# Altium schematic sheet power.SchDoc
size A4
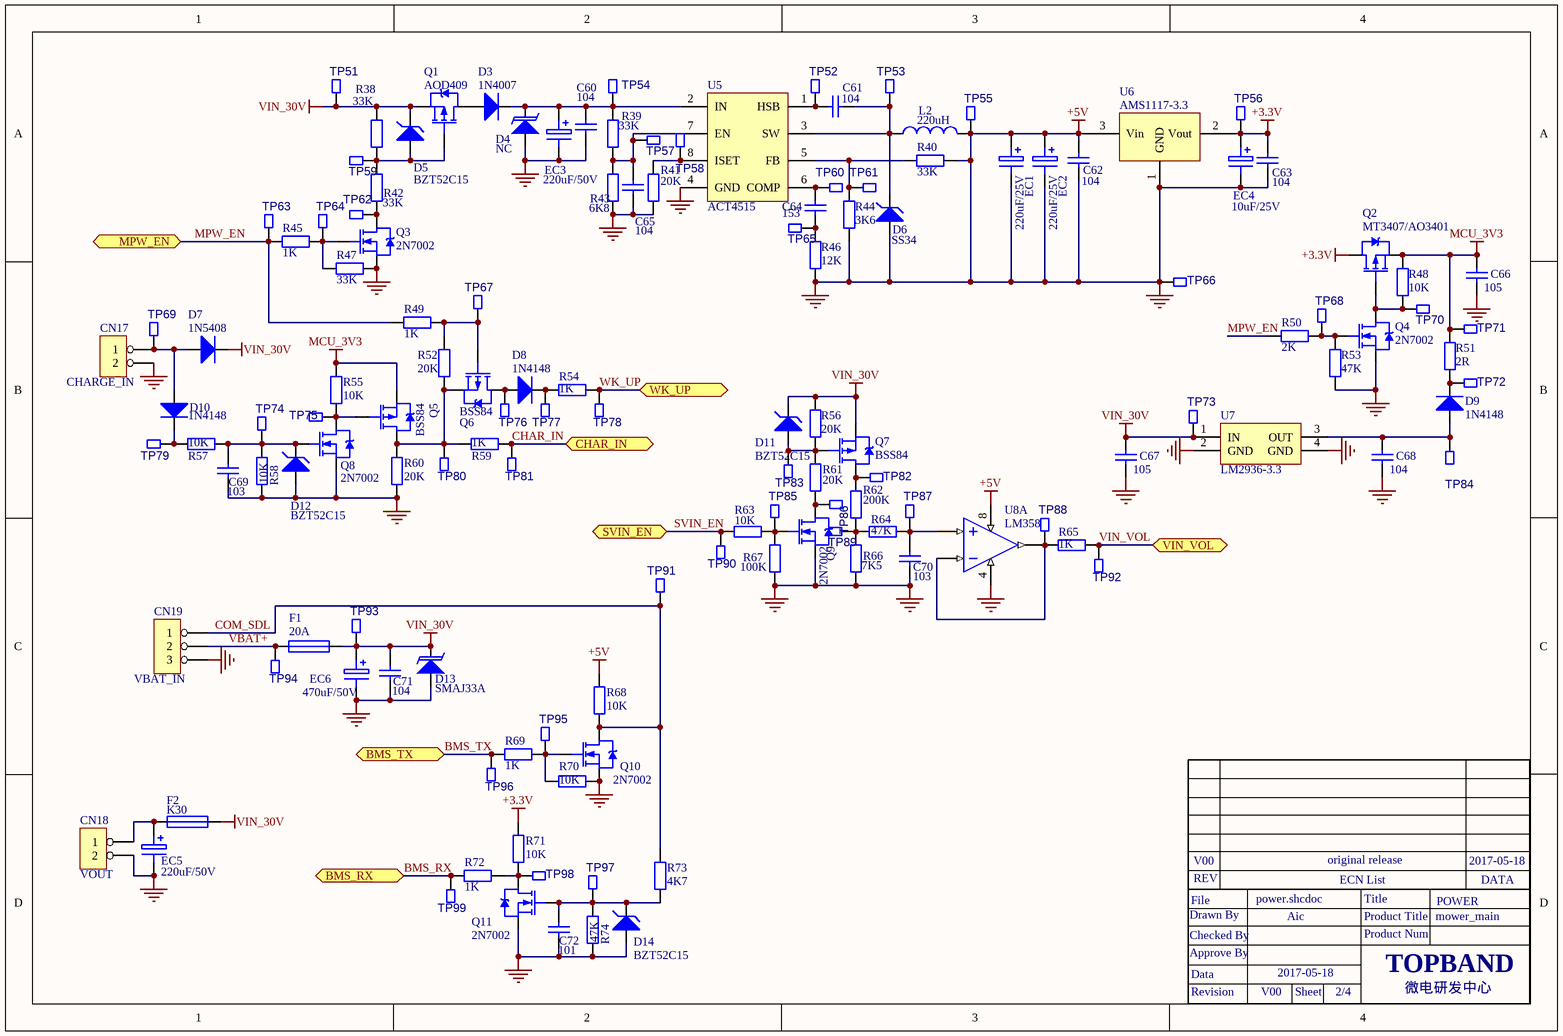
[diagram p0: power.SchDoc]

## Parts
C60  104  [0603C]
C61  104  [0603C]
C62  104  [0603C]
C63  104  [0603C]
C64  153  [0603C]
C65  104  [0603C]
C66  105  [0603C]
C67  105  [0603C]
C68  104  [0603C]
C69  103  [0603C]
C70  103  [0603C]
C71  104  [0805C]
C72  101  [0603C]
CN17  CHARGE_IN  [CON2-2.54]
CN18  VOUT  [CON2-3.96]
CN19  VBAT_IN  [CON3-3.96]
D3  1N4007  [SMA]
D4  NC  [SOD-123]
D5  BZT52C15  [SOD-123]
D6  SS34  [SMA]
D7  1N5408  [DIODE]
D8  1N4148  [SOD-123]
D9  1N4148  [SOD-123]
D10  1N4148  [SOD-123]
D11  BZT52C15  [SOD-123]
D12  BZT52C15  [SOD-123]
D13  SMAJ33A  [DO-214AC]
D14  BZT52C15  [SOD-123]
EC1  220uF/25V  [EC10]
EC2  220uF/25V  [EC10]
EC3  220uF/50V  [EC10]
EC4  10uF/25V  [EC4]
EC5  220uF/50V  [EC10]
EC6  470uF/50V  [EC12.5]
F1  20A  [  ]
F2  K30  [ ]
L2  220uH  [150700618]
Q1  AOD409  [D-PACK-GDS]
Q2  MT3407/AO3401  [SOT23-GDS]
Q3  2N7002  [SOT23-GDS]
Q4  2N7002  [SOD23-GDS]
Q5  BSS84  [SOT-23-GDS]
Q6  BSS84  [SOT-23-GDS]
Q7  BSS84  [SOT-23-GDS]
Q8  2N7002  [SOT-23-GDS]
Q9  2N7002  [SOT-23-GDS]
Q10  2N7002  [SOT-23-GDS]
Q11  2N7002  [SOT-23-GDS]
R38  33K  [0603R]
R39  33K  [0603R]
R40  33K  [0603R]
R41  20K  [0603R]
R42  33K  [0603R]
R43  6K8  [0603R]
R44  3K6  [0603R]
R45  1K  [0603R]
R46  12K  [0603R]
R47  33K  [0603R]
R48  10K  [0603R]
R49  1K  [0603R]
R50  2K  [0603R]
R51  2R  [1206R]
R52  20K  [0603R]
R53  47K  [0603R]
R54  1K  [0603R]
R55  10K  [0603R]
R56  20K  [0603R]
R57  10K  [0603R]
R58  10K  [0603R]
R59  1K  [0603R]
R60  20K  [0603R]
R61  20K  [0603R]
R62  200K  [0603R]
R63  10K  [0603R]
R64  47K  [0603R]
R65  1K  [0603R]
R66  7K5  [0603R]
R67  100K  [0603R]
R68  10K  [0603R]
R69  1K  [0603R]
R70  10K  [0603R]
R71  10K  [0603R]
R72  1K  [0603R]
R73  4K7  [0603R]
R74  47K  [0603R]
TP51  TP  [TEST-0.8MM]  (value not drawn)
TP52  TP  [TEST-0.8MM]  (value not drawn)
TP53  TP  [TEST-0.8MM]  (value not drawn)
TP54  TP  [TEST-0.8MM]  (value not drawn)
TP55  TP  [TEST-0.8MM]  (value not drawn)
TP56  TP  [TEST-0.8MM]  (value not drawn)
TP57  TP  [TEST-0.8MM]  (value not drawn)
TP58  TP  [TEST-0.8MM]  (value not drawn)
TP59  TP  [TEST-0.8MM]  (value not drawn)
TP60  TP  [TEST-0.8MM]  (value not drawn)
TP61  TP  [TEST-0.8MM]  (value not drawn)
TP62  TP  [TEST-0.8MM]  (value not drawn)
TP63  TP  [TEST-0.8MM]  (value not drawn)
TP64  TP  [TEST-0.8MM]  (value not drawn)
TP65  TP  [TEST-0.8MM]  (value not drawn)
TP66  TP  [TEST-0.8MM]  (value not drawn)
TP67  TP  [TEST-0.8MM]  (value not drawn)
TP68  TP  [TEST-0.8MM]  (value not drawn)
TP69  TP  [TEST-0.8MM]  (value not drawn)
TP70  TP  [TEST-0.8MM]  (value not drawn)
TP71  TP  [TEST-0.8MM]  (value not drawn)
TP72  TP  [TEST-0.8MM]  (value not drawn)
TP73  TP  [TEST-0.8MM]  (value not drawn)
TP74  TP  [TEST-0.8MM]  (value not drawn)
TP75  TP  [TEST-0.8MM]  (value not drawn)
TP76  TP  [TEST-0.8MM]  (value not drawn)
TP77  TP  [TEST-0.8MM]  (value not drawn)
TP78  TP  [TEST-0.8MM]  (value not drawn)
TP79  TP  [TEST-0.8MM]  (value not drawn)
TP80  TP  [TEST-0.8MM]  (value not drawn)
TP81  TP  [TEST-0.8MM]  (value not drawn)
TP82  TP  [TEST-0.8MM]  (value not drawn)
TP83  TP  [TEST-0.8MM]  (value not drawn)
TP84  TP  [TEST-0.8MM]  (value not drawn)
TP85  TP  [TEST-0.8MM]  (value not drawn)
TP86  TP  [TEST-0.8MM]  (value not drawn)
TP87  TP  [TEST-0.8MM]  (value not drawn)
TP88  TP  [TEST-0.8MM]  (value not drawn)
TP89  TP  [TEST-0.8MM]  (value not drawn)
TP90  TP  [TEST-0.8MM]  (value not drawn)
TP91  TP  [TEST-0.8MM]  (value not drawn)
TP92  TP  [TEST-0.8MM]  (value not drawn)
TP93  TP  [TEST-0.8MM]  (value not drawn)
TP94  TP  [TEST-0.8MM]  (value not drawn)
TP95  TP  [TEST-0.8MM]  (value not drawn)
TP96  TP  [TEST-0.8MM]  (value not drawn)
TP97  TP  [TEST-0.8MM]  (value not drawn)
TP98  TP  [TEST-0.8MM]  (value not drawn)
TP99  TP  [TEST-0.8MM]  (value not drawn)
U5  ACT4515  [SOP-8]
U6  AMS1117-3.3  [SOT-223]
U7  LM2936-3.3  [SOT-223]
U8  LM358  [SO-8]  (part A of 2)

## Ports
BMS_RX, BMS_TX, CHAR_IN, MPW_EN, SVIN_EN, VIN_VOL, WK_UP

## Nets
+3.3V: C63.1 EC4.1 Q2.D R71.1 TP56.1 U6.2(Vout)
+5V: C60.2 C62.1 C62.2 C63.2 C65.2 C66.2 C67.2 C68.2 C69.1 C70.2 C71.1 C72.1 CN17.2 CN18.2 CN19.3 D4.A D6.A D12.A D13.A D14.A EC1.1 EC1.2 EC2.1 EC2.2 EC3.2 EC4.2 EC5.2 EC6.2 L2.2 Q3.S Q4.S Q8.S Q9.S Q10.S Q11.S R40.1 R41.2 R43.2 R44.1 R46.1 R47.2 R53.1 R58.2 R60.2 R66.2 R67.2 R68.1 R70.1 R74.2 TP55.1 TP66.1 U5.4(GND) U6.1(GND) U6.3(Vin) U7.2(GND) U7.4(GND) U8.4(GND) U8.8(VCC)  [also labelled GND]
MCU_3V3: C66.1 Q2.S Q5.S R48.2 R51.2 R55.1 TP71.1
VIN_30V: C67.1 C71.2 D5.K D7.K D11.K D13.K EC6.1 F1.2 F2.2 Q1.S Q7.S R38.2 R56.2 TP51.1 TP73.1 TP93.1 U7.1(IN)
BMS_RX: R72.1 TP99.1 ; port BMS_RX
BMS_TX: R69.1 TP96.1 ; port BMS_TX
CHAR_IN: R59.2 TP81.1 ; port CHAR_IN
COM_SDL: CN19.1 Q10.D R68.2 R73.1 TP91.1
MPW_EN: R45.1 R49.1 R50.2 TP63.1 ; port MPW_EN
SVIN_EN: R63.2 TP90.1 ; port SVIN_EN
VBAT+: CN19.2 F1.1 TP94.1
VIN_VOL: R65.2 TP92.1 ; port VIN_VOL
WK_UP: R54.2 TP78.1 ; port WK_UP
NetC60_1: C60.1 D3.K D4.K EC3.1 R39.1 TP54.1 U5.2(IN)
NetC61_1: C61.1 TP52.1 U5.1(HSB)
NetC61_2: C61.2 D6.K L2.1 TP53.1 U5.3(SW)
NetC64_1: C64.1 TP60.1 U5.6(COMP)
NetC64_2: C64.2 R46.2 TP65.1
NetC65_1: C65.1 R39.2 R43.1 TP57.1 U5.7(EN)
NetC68_1: C68.1 D9.A TP84.1 U7.3(OUT)
NetC69_2: C69.2 D12.K Q8.G R57.1 R58.1 TP74.1
NetC70_1: C70.1 R64.1 TP87.1 U8.5(+IN1)
NetC72_2: C72.2 D14.K Q11.G R73.2 R74.1 TP97.1
NetCN17_1: CN17.1 D7.A D10.A TP69.1
NetCN18_1: CN18.1 EC5.1 F2.1
NetD3_A: D3.A Q1.D
NetD5_A: D5.A Q1.G R38.1 R42.1 TP59.1
NetD8_A: D8.A Q6.D TP76.1
NetD8_K: D8.K R54.1 TP77.1
NetD9_K: D9.K R51.1 TP72.1
NetD10_K: D10.K R57.2 TP79.1
NetD11_A: D11.A Q7.G R56.1 R61.2 TP83.1
NetQ2_G: Q2.G Q4.D R48.1 TP70.1
NetQ3_D: Q3.D R42.2 TP62.1
NetQ3_G: Q3.G R45.2 R47.1 TP64.1
NetQ4_G: Q4.G R50.1 R53.2 TP68.1
NetQ5_D: Q5.D Q6.S R52.1 R59.1 R60.1 TP80.1
NetQ5_G: Q5.G Q8.D R55.2 TP75.1
NetQ6_G: Q6.G R49.2 R52.2 TP67.1
NetQ7_D: Q7.D R62.1 TP82.1
NetQ9_D: Q9.D R61.1 TP86.1
NetQ9_G: Q9.G R63.1 R67.1 TP85.1
NetQ10_G: Q10.G R69.2 R70.2 TP95.1
NetQ11_D: Q11.D R71.2 R72.2 TP98.1
NetR40_2: R40.2 R44.2 TP61.1 U5.5(FB)
NetR41_1: R41.1 TP58.1 U5.8(ISET)
NetR62_2: R62.2 R64.2 R66.1 TP89.1
NetR65_1: R65.1 TP88.1 U8.6(-IN1) U8.7(OUT1)

## Notes on the sheet
- Drawn By
- File
- REV
- V00
- power.shcdoc
- Aic
- original release
- ECN List
- Product Title
- Title
- mower_main
- POWER
- 2017-05-18
- DATA
- Approve By
- Checked By
- Data
- Product Num
- TOPBAND
- Revision
- Sheet
- 2/4
- 微电研发中心

## Library data of the parts
C60-C69 C71 C72 = Cap(0603): Component Kind: standard; Component Type: standard
C70 = Cap(0603): 120201069; U_TABLE: U_SAM010202; id: 112; Description: 电容器; U_ITEM_ID（物料编码）: 120200381; U_100114（SAP物料描述）: SMT电容0603_X7R_103/50V_K_环保; U_100116（标称值-浮点）: 0.01; U_100013（单位）: uF; U_100083（允许偏差）: K; U_100069（温度特性）: X7R; U_100040（封装方式）: 0603; U_100027（额定电压）: 50V; U_100047（环保属性）: 环保; U_100105（工厂库存）: 1000:8376.000;1100:12848.000;1200:3131.000;1300:0.000;1500:2302.000;1600:309.000;2000:10671.000;30; U_100107（工厂BOM使用频率）: 1000:138;1100:98;1200:59;1300:2;1500:32;1600:6;2000:196;3000:3;4000:33;5000:30;; U_100109（物料优选级）: 1; U_100117（工厂采购量）: 1000:376000.000;1100:212000.000;1200:84000.000;1300:4000.000;1500:4000.000;2000:148000.000;4000:72; Part Number: Cap(0603); Component Kind: standard; Component Type: standard; U_100012（标称值-文本）: 103
CN17 CN18 = 2Pin(卧式): 插座; U_TABLE: U_SAM01021601; id: 20; Part Number: 2Pin(卧式); Component Kind: Standard; Component Type: Standard; Designator: 2Pin(卧式); Footprint: CON2-2.54卧式; Pin Count: 2
CN19 = 3Pin(2~3.96mm): 插座; U_TABLE: U_SAM01021601; id: 24; Part Number: 3Pin(2~3.96mm); Component Kind: Standard; Component Type: Standard; Designator: 3Pin(2~3.96mm); Footprint: CON3-2.0; Pin Count: 3
D3 D7-D10 = Diode(DO-35)-D: 二极管; U_TABLE: U_SAM010203; id: 32; Part Number: Diode(DO-35)-D; Component Kind: standard; Component Type: standard; Pin Count: 2
D4 = Diode(TVS_贴片)_1: TVS管; U_TABLE: U_SAM010203; id: 28; Part Number: Diode(TVS_贴片)_1; Component Kind: standard; Component Type: standard; Pin Count: 2
D5 D6 = D Zener(贴片): 120301465; U_TABLE: U_SAM010203; id: 25; Description: 稳压二极管; Part Number: D Zener(贴片); Component Kind: standard; Component Type: standard; Pin Count: 2
D11 D12 D14 = D Zener(贴片): 120301303; U_TABLE: U_SAM010203; id: 25; Description: 稳压二极管; Part Number: D Zener(贴片); Component Kind: standard; Component Type: standard; Pin Count: 2
D13 = Diode(TVS_贴片)_1: 120301346; U_TABLE: U_SAM010203; id: 28; Description: TVS管; Part Number: Diode(TVS_贴片)_1; Component Kind: standard; Component Type: standard; Pin Count: 2
EC1-EC5 = Electro(2.5mm): 电解电容; U_TABLE: U_SAM010202; id: 42; Part Number: Electro(2.5mm); Component Kind: standard; Component Type: standard; Pin Count: 2
EC6 = Electro(2.5mm): 150200079; U_TABLE: U_SAM010202; id: 42; Description: 电解电容; Part Number: Electro(2.5mm); Component Kind: standard; Component Type: standard; Pin Count: 2
F1 F2 = Fuse(1206): 121100112; U_TABLE: U_SAM010211; id: 119; Description: 保险管; Part Number: Fuse(1206); Component Kind: standard; Component Type: standard
L2 = Inductor(0805): 150700618; U_TABLE: U_SAM010207; id: 140; Description: 电感; Part Number: Inductor(0805); Component Kind: standard; Component Type: standard
Q1 Q2 = PMOS-2: MOS管; U_TABLE: U_SAM010204; id: 19; Part Number: PMOS-2; Component Kind: standard; Component Type: standard; Pin Count: 3
Q3 Q4 = NMOS-2: MOS管; U_TABLE: U_SAM010204; id: 17; Part Number: NMOS-2; Component Kind: standard; Component Type: standard; Pin Count: 3
Q5-Q7 = PMOS-2: 120400638; U_TABLE: U_SAM010204; id: 19; Description: MOS管; U_100114（SAP物料描述）: SMT_MOS管BSS84LT1G_130mA50V_P_SOT23_ON环; U_100076（型号）: BSS84LT1G; U_100040（封装方式）: SOT23; U_100058（漏源最大电流）: 130m; U_100057（漏源击穿电压）: 50V; U_100050（极性类型）: P; U_100047（环保属性）: 环保; U_100107（工厂BOM使用频率）: 1000:3;; U_100105（工厂库存）: 1000:4127.000;2000:0.000;3000:0.000;; U_100117（工厂采购量）: 1000:6000.000;; Part Number: PMOS-2; Component Kind: standard; Component Type: standard; Pin Count: 3; U_ITEM_ID（物料编码）: 120400638; U_100086（指定供应商）: ON
Q8-Q11 = NMOS-2: 120401068; U_TABLE: U_SAM010204; id: 17; Description: MOS管; Part Number: NMOS-2; Component Kind: standard; Component Type: standard; Pin Count: 3
R38-R44 R46-R48 R50 R51 R53 = Res2: Resistor; Value: 1K; 物料编码: 150103083; Published: 8-Jun-2000; LatestRevisionDate: 17-Jul-2002; LatestRevisionNote: Re-released for DXP Platform.; PackageReference: AXIAL-0.4; Publisher: Altium Limited
R45 = Res2: Resistor; 物料编码: 150103083; Published: 8-Jun-2000; LatestRevisionDate: 17-Jul-2002; LatestRevisionNote: Re-released for DXP Platform.; PackageReference: AXIAL-0.4; Publisher: Altium Limited; Value: 1K
R49 R52 R54 R55 R58-R60 R65 R67-R69 R71-R74 = Res(0603): 120101780; U_TABLE: U_SAM010201; id: 106; Description: 电阻器; U_ITEM_ID（物料编码）: 120101577; U_100114（SAP物料描述）: SMT电阻RR0603_104_J_1/10W_50V_环保; U_100012（标称值-文本）: 104; U_100116（标称值-浮点）: 100; U_100013（单位）: KΩ; U_100083（允许偏差）: J; U_100029（额定功率）: 1/10W; U_100040（封装方式）: RR0603; U_100049（极限电压）: 50V; U_100047（环保属性）: 环保; U_100107（工厂BOM使用频率）: 1000:11;1500:1;2000:22;4000:24;5000:18;; U_100105（工厂库存）: 1000:6199.000;1200:0.000;1300:0.000;1500:3629.000;2000:599.000;3000:0.000;4000:3400.000;5000:26880; U_100117（工厂采购量）: 1000:160000.000;1500:5000.000;2000:5000.000;5000:105000.000;; Part Number: Res(0603); Component Kind: standard; Component Type: standard
R56 = Res(1206): 120101845; U_TABLE: U_SAM010201; id: 108; Description: 电阻器; U_ITEM_ID（物料编码）: 120100327; U_100114（SAP物料描述）: SMT电阻RR0603_2002_F_1/16W_50V_环保; U_100012（标称值-文本）: 2002; U_100116（标称值-浮点）: 20; U_100013（单位）: KΩ; U_100083（允许偏差）: F; U_100029（额定功率）: 1/16W; U_100040（封装方式）: RR0603; U_100049（极限电压）: 50V; U_100047（环保属性）: 环保; U_100107（工厂BOM使用频率）: 1000:6;1100:36;1300:1;1500:7;2000:18;4000:12;5000:11;; U_100105（工厂库存）: 1000:72.000;1100:70212.000;1300:1690299.000;1500:95.000;2000:647.000;3000:38.000;4000:9278.000;500; U_100117（工厂采购量）: 1300:8055000.000;2000:5000.000;4000:15000.000;5000:5000.000;; Part Number: Res(1206); Component Kind: standard; Component Type: standard
R57 R61 R63 R70 = Res(0603): 120101742; U_TABLE: U_SAM010201; id: 106; Description: 电阻器; U_ITEM_ID（物料编码）: 120100300; U_100114（SAP物料描述）: SMT电阻RR0603_103_J_1/16W_50V_环保; U_100012（标称值-文本）: 103; U_100116（标称值-浮点）: 10; U_100013（单位）: KΩ; U_100083（允许偏差）: J; U_100029（额定功率）: 1/16W; U_100040（封装方式）: RR0603; U_100049（极限电压）: 50V; U_100047（环保属性）: 环保; U_100107（工厂BOM使用频率）: 1000:61;1100:109;1500:33;2000:188;4000:70;5000:360;7000:125;; U_100105（工厂库存）: 1000:38528.000;1100:0.000;1300:0.000;1500:14371.000;2000:43462.000;3000:0.000;4000:50923.000;5000:; U_100117（工厂采购量）: 1000:170000.000-;1100:5000.000;1500:15000.000;2000:155000.000;4000:120000.000;5000:5000.000;7000:2; Part Number: Res(0603); Component Kind: standard; Component Type: standard; U_100104（初始供应商）: 深圳市泽天电子有限公
R62 = Res(0603): 120100695; U_TABLE: U_SAM010201; id: 106; Description: 电阻器; U_ITEM_ID（物料编码）: 120101818; U_100114（SAP物料描述）: SMT电阻RR0603_2003_F_1/16W_50V_国巨_; U_100012（标称值-文本）: 2003; U_100116（标称值-浮点）: 200; U_100013（单位）: KΩ; U_100083（允许偏差）: F; U_100029（额定功率）: 1/16W; U_100040（封装方式）: RR0603; U_100049（极限电压）: 50V; U_100047（环保属性）: 环保; U_100105（工厂库存）: 1200:0.000;; Part Number: Res(0603); Component Kind: standard; Component Type: standard; U_100086（指定供应商）: 国巨
R64 = Res(0603): 120101780; U_TABLE: U_SAM010201; id: 106; Description: 电阻器; U_ITEM_ID（物料编码）: 120100565; U_100114（SAP物料描述）: SMT电阻RR0603_473_J_1/16W_50V_环保; U_100012（标称值-文本）: 473; U_100116（标称值-浮点）: 47; U_100013（单位）: KΩ; U_100083（允许偏差）: J; U_100029（额定功率）: 1/16W; U_100040（封装方式）: RR0603; U_100049（极限电压）: 50V; U_100047（环保属性）: 环保; U_100107（工厂BOM使用频率）: 1000:34;1500:6;2000:16;3000:5;4000:23;5000:11;7000:34;; U_100105（工厂库存）: 1000:4820.000;1100:3091.000;1300:0.000;1500:0.000;2000:1452.000;3000:1000.000;4000:45078.000;5000:; U_100117（工厂采购量）: 1000:5000.000;2000:5000.000;4000:310000.000;5000:5000.000;; Part Number: Res(0603); Component Kind: standard; Component Type: standard; U_100104（初始供应商）: 泽天
R66 = Res(0603): 120100221; U_TABLE: U_SAM010201; id: 106; Description: 电阻器; U_ITEM_ID（物料编码）: 120101813; U_100114（SAP物料描述）: SMT电阻RR0603_1502_F_1/16W_50V_国巨_; U_100012（标称值-文本）: 1502; U_100116（标称值-浮点）: 15; U_100013（单位）: KΩ; U_100083（允许偏差）: F; U_100029（额定功率）: 1/16W; U_100040（封装方式）: RR0603; U_100049（极限电压）: 50V; U_100047（环保属性）: 环保; U_100107（工厂BOM使用频率）: 2000:8;; U_100105（工厂库存）: 1200:0.000;2000:3965.000;3000:0.000;; U_100117（工厂采购量）: 2000:5000.000;; Part Number: Res(0603); Component Kind: standard; Component Type: standard; U_100086（指定供应商）: 国巨
U7 = LM2936
U8 = IC_LM358: 121000225; U_TABLE: U_SAM010210; Description: 集成电路; id: 83; U_ITEM_ID（物料编码）: 121000100; U_100114（SAP物料描述）: SMT运放LM358_SO-8_TI_环保; U_100047（环保属性）: 环保; U_100107（工厂BOM使用频率）: 1000:1;1500:12;3000:7;5000:14;; U_100105（工厂库存）: 1000:7508.000;1500:160.000;2000:0.000;3000:485.000;5000:1542.000;; U_100117（工厂采购量）: 1000:7500.000;1500:300.000;3000:2500.000;5000:7500.000;; Part Number: IC_LM358; Component Kind: standard; Component Type: standard; Designator: IC_LM358; Footprint: DIP14; Pin Count: 8; U_100076（型号）: LM358; U_100040（封装方式）: SO-8; U_100086（指定供应商）: TI